# EAGLE design Nucleo_Mouse_v2 (EAGLE 9.6.2)
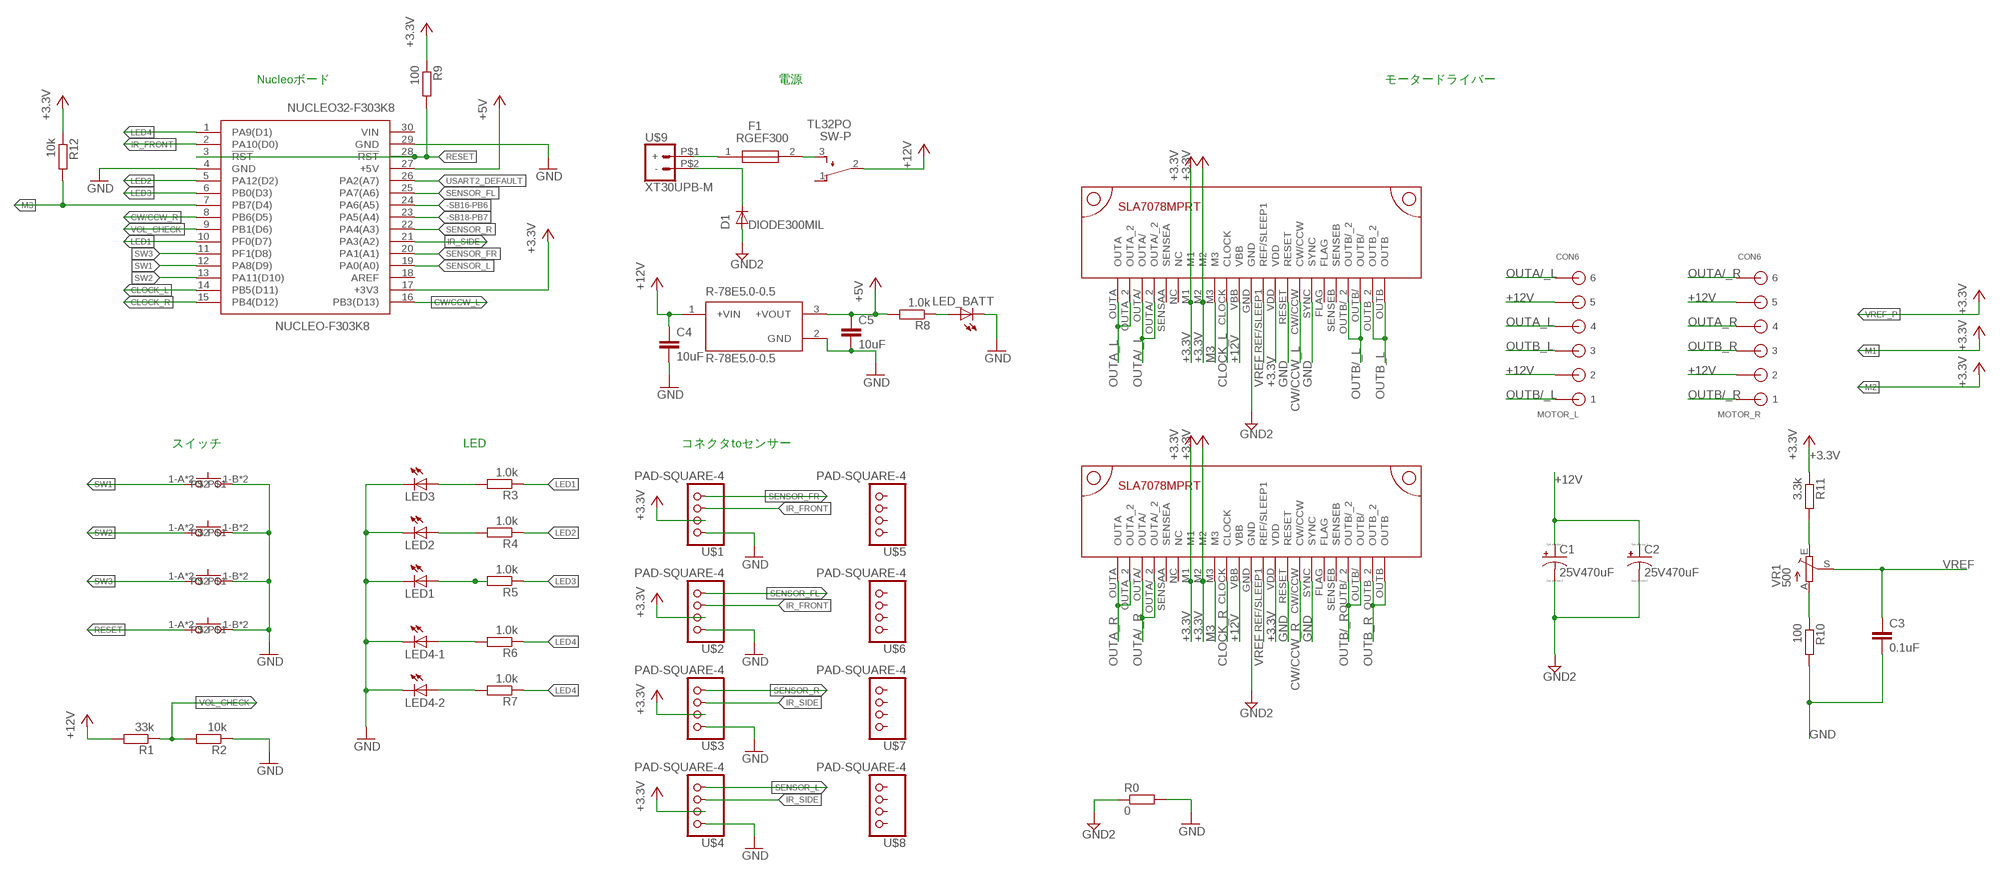
[diagram p0: schematic, sheet 1]

## Parts
C1  25V470uF  CPOL-USE5-10.5  [E5-10,5]
C2  25V470uF  CPOL-USE5-10.5  [E5-10,5]
C3  0.1uF  C-EU050-024X044  [C050-024X044]
C4  10uF  C-EU050-024X044  [C050-024X044]
C5  10uF  C-EU050-024X044  [C050-024X044]
D1  DIODE300MIL  [D-7.5]
DRIVER_L  SLA7078VANILLA  [SLA7078_VANILLA]
DRIVER_R  SLA7078VANILLA  [SLA7078_VANILLA]
F1  RGEF300  [RGEF300]
LED1  LED3MM  [LED3MM]
LED2  LED3MM  [LED3MM]
LED3  LED3MM  [LED3MM]
LED4-1  LED3MM  [LED3MM]
LED4-2  LED3MM  [LED3MM]
LED_BATT  LED3MM  [LED3MM]
MOTOR_L  CON6  [CON6]
MOTOR_R  CON6  [CON6]
NUCLEO32-F303K8  NUCLEO-F303K8  [DIPS1524W66P254L5029H1500Q30N]
R0  0  R-EU_0204/7  [0204/7]
R1  33k  R-EU_0204/7  [0204/7]
R2  10k  R-EU_0204/7  [0204/7]
R3  1.0k  R-EU_0204/7  [0204/7]
R4  1.0k  R-EU_0204/7  [0204/7]
R5  1.0k  R-EU_0204/7  [0204/7]
R6  1.0k  R-EU_0204/7  [0204/7]
R7  1.0k  R-EU_0204/7  [0204/7]
R8  1.0k  R-EU_0204/7  [0204/7]
R9  100  R-EU_0204/7  [0204/7]
R10  100  R-EU_0204/7  [0204/7]
R11  3.3k  R-EU_0204/7  [0204/7]
R12  10k  R-EU_0204/7  [0204/7]
R-78E5.0-0.5  R-78E5.0-0.5  [CONV_R-78E5.0-0.5]
SW1  TACT_SW  [AKI_TACT]
SW2  TACT_SW  [AKI_TACT]
SW3  TACT_SW  [AKI_TACT]
SW-P  TL32PO  [TL3XPO]
SW_RESET  TACT_SW  [AKI_TACT]
U$1  PAD-SQUARE-4  [PAD-SQUARE-2.54]
U$2  PAD-SQUARE-4  [PAD-SQUARE-2.54]
U$3  PAD-SQUARE-4  [PAD-SQUARE-2.54]
U$4  PAD-SQUARE-4  [PAD-SQUARE-2.54]
U$5  PAD-SQUARE-4  [PAD-SQUARE-2.54]
U$6  PAD-SQUARE-4  [PAD-SQUARE-2.54]
U$7  PAD-SQUARE-4  [PAD-SQUARE-2.54]
U$8  PAD-SQUARE-4  [PAD-SQUARE-2.54]
U$9  XT30UPB-M  [XT30UPB-M]
VR1  500  TRIM_EU-B25P  [B25P]

## Nets
+3.3V: DRIVER_L.M1 DRIVER_L.M2 DRIVER_L.VDD DRIVER_R.M1 DRIVER_R.M2 DRIVER_R.VDD NUCLEO32-F303K8.17(+3V3) R9.1 R11.1 R12.1 U$1.2-1 U$1.2-2 U$2.2-1 U$2.2-2 U$3.2-1 U$3.2-2 U$4.2-1 U$4.2-2
+5V: C5.1 NUCLEO32-F303K8.27(+5V) R8.2 R-78E5.0-0.5.3(+VOUT)
+12V: C1.+ C2.+ C4.1 DRIVER_L.VBB DRIVER_R.VBB MOTOR_L.P$2 MOTOR_L.P$5 MOTOR_R.P$2 MOTOR_R.P$5 R1.2 R-78E5.0-0.5.1(+VIN) SW-P.2(P)
-SB16-PB6: NUCLEO32-F303K8.24(PA6(A5))
-SB18-PB7: NUCLEO32-F303K8.23(PA5(A4))
CLOCK_L: DRIVER_L.CLOCK NUCLEO32-F303K8.14(PB5(D11))
CLOCK_R: DRIVER_R.CLOCK NUCLEO32-F303K8.15(PB4(D12))
CW/CCW_L: DRIVER_L.CW/CCW NUCLEO32-F303K8.16(PB3(D13))
CW/CCW_R: DRIVER_R.CW/CCW NUCLEO32-F303K8.8(PB6(D5))
GND: C3.2 C4.2 C5.2 DRIVER_L.RESET DRIVER_L.SYNC DRIVER_R.RESET DRIVER_R.SYNC LED1.K(C) LED2.K(C) LED3.K(C) LED4-1.K(C) LED4-2.K(C) LED_BATT.K(C) NUCLEO32-F303K8.4(GND) NUCLEO32-F303K8.29(GND) R0.2 R2.1 R10.2 R-78E5.0-0.5.2(GND) SW1.1-B SW1.2-B SW2.1-B SW2.2-B SW3.1-B SW3.2-B SW_RESET.1-B SW_RESET.2-B U$1.1-1 U$1.1-2 U$2.1-1 U$2.1-2 U$3.1-1 U$3.1-2 U$4.1-1 U$4.1-2
GND2: C1.- C2.- D1.A DRIVER_L.GND DRIVER_R.GND R0.1
IR_FRONT: NUCLEO32-F303K8.2(PA10(D0)) U$1.3-1 U$1.3-2 U$2.3-1 U$2.3-2
IR_SIDE: NUCLEO32-F303K8.21(PA3(A2)) U$3.3-1 U$3.3-2 U$4.3-1 U$4.3-2
LED1: NUCLEO32-F303K8.10(PF0(D7)) R3.1
LED2: NUCLEO32-F303K8.5(PA12(D2)) R4.1
LED3: NUCLEO32-F303K8.6(PB0(D3)) R5.1
LED4: NUCLEO32-F303K8.1(PA9(D1)) R6.1 R7.1
M3: DRIVER_L.M3 DRIVER_R.M3 NUCLEO32-F303K8.7(PB7(D4)) R12.2
N$1: F1.1 U$9.P$1(+)
N$2: LED4-1.A R6.2
N$3: LED4-2.A R7.2
N$4: LED3.A R3.2
N$5: LED2.A R4.2
N$6: LED1.A R5.2
N$7: LED_BATT.A R8.1
N$8: D1.C U$9.P$2(-)
N$9: F1.2 SW-P.3(S)
N$10: R10.1 VR1.A
N$11: R11.2 VR1.E
OUTA/_L [power]: DRIVER_L.OUTA/ DRIVER_L.OUTA/_2 MOTOR_L.P$6
OUTA/_R [power]: DRIVER_R.OUTA/ DRIVER_R.OUTA/_2 MOTOR_R.P$6
OUTA_L [power]: DRIVER_L.OUTA DRIVER_L.OUTA_2 MOTOR_L.P$4
OUTA_R [power]: DRIVER_R.OUTA DRIVER_R.OUTA_2 MOTOR_R.P$4
OUTB/_L [power]: DRIVER_L.OUTB/ DRIVER_L.OUTB/_2 MOTOR_L.P$1
OUTB/_R [power]: DRIVER_R.OUTB/ DRIVER_R.OUTB/_2 MOTOR_R.P$1
OUTB_L [power]: DRIVER_L.OUTB DRIVER_L.OUTB_2 MOTOR_L.P$3
OUTB_R [power]: DRIVER_R.OUTB DRIVER_R.OUTB_2 MOTOR_R.P$3
RESET: NUCLEO32-F303K8.3(!RST) NUCLEO32-F303K8.28(!RST) R9.2 SW_RESET.1-A SW_RESET.2-A
SENSOR_FL: NUCLEO32-F303K8.25(PA7(A6)) U$2.4-1 U$2.4-2
SENSOR_FR: NUCLEO32-F303K8.20(PA1(A1)) U$1.4-1 U$1.4-2
SENSOR_L: NUCLEO32-F303K8.19(PA0(A0)) U$4.4-1 U$4.4-2
SENSOR_R: NUCLEO32-F303K8.22(PA4(A3)) U$3.4-1 U$3.4-2
SW1: NUCLEO32-F303K8.12(PA8(D9)) SW1.1-A SW1.2-A
SW2: NUCLEO32-F303K8.13(PA11(D10)) SW2.1-A SW2.2-A
SW3: NUCLEO32-F303K8.11(PF1(D8)) SW3.1-A SW3.2-A
USART2_DEFAULT: NUCLEO32-F303K8.26(PA2(A7))
VOL_CHECK: NUCLEO32-F303K8.9(PB1(D6)) R1.1 R2.2
VREF [signal]: C3.1 DRIVER_L.REF/SLEEP1 DRIVER_R.REF/SLEEP1 VR1.S
Unconnected: DRIVER_L.FLAG DRIVER_L.NC DRIVER_L.SENSAA(SENSEA) DRIVER_L.SENSEB DRIVER_R.FLAG DRIVER_R.NC DRIVER_R.SENSAA(SENSEA) DRIVER_R.SENSEB NUCLEO32-F303K8.18(AREF) NUCLEO32-F303K8.30(VIN) SW-P.1(O) U$5.1-1 U$5.1-2 U$5.2-1 U$5.2-2 U$5.3-1 U$5.3-2 U$5.4-1 U$5.4-2 U$6.1-1 U$6.1-2 U$6.2-1 U$6.2-2 U$6.3-1 U$6.3-2 U$6.4-1 U$6.4-2 U$7.1-1 U$7.1-2 U$7.2-1 U$7.2-2 U$7.3-1 U$7.3-2 U$7.4-1 U$7.4-2 U$8.1-1 U$8.1-2 U$8.2-1 U$8.2-2 U$8.3-1 U$8.3-2 U$8.4-1 U$8.4-2

## Notes on the sheet
- Nucleoボード | 電源 | モータードライバー
- スイッチ | LED | コネクタtoセンサー

## Library data of the parts
C1 C2 = 02_capacitor:CPOL-US: POLARIZED CAPACITOR, American symbol
C3-C5 = 02_capacitor:C-EU: CAPACITOR, European symbol
D1 = AT:DIODE
DRIVER_L DRIVER_R = 03_MicroMouse:SLA7078
F1 = SamacSys_Parts:RGEF300: Littelfuse 3A Radial Leaded PCB Mount Resettable Fuse, 16V Source: Datasheet <http://www.littelfuse.com/~/media/electronics/datasheets/resettable_ptcs/littelfuse_ptc_rline_catalog_datasheet.pdf.pdf>; DESCRIPTION: Littelfuse 3A Radial Leaded PCB Mount Resettable Fuse, 16V; HEIGHT: 11mm; MANUFACTURER_NAME: LITTELFUSE; MANUFACTURER_PART_NUMBER: RGEF300; MOUSER_PART_NUMBER: 650-RGEF300; MOUSER_PRICE-STOCK: https://www.mouser.co.uk/ProductDetail/Littelfuse/RGEF300?qs=F6FIpiMdEVbYGAo7XYOVkg%3D%3D
LED1-LED3 LED4-1 LED4-2 LED_BATT = MicroMouseYR:LED: LEDs Standard schematic elements and footprints for 5mm, 3mm, 1206, and 0603 sized LEDs. 5mm - Spark Fun Electronics SKU : COM-00529 (and others)
MOTOR_L MOTOR_R = 03_MicroMouse:CON6: low insertion connector 6
NUCLEO32-F303K8 = NUCLEO-F303K8_2:NUCLEO-F303K8: STM32 Nucleo-32 development board Source: Datasheet <http://www.st.com/content/ccc/resource/technical/document/data_brief/b1/d8/13/d4/b0/b7/4b/6e/DM00214578.pdf/files/DM00214578.pdf/jcr:content/translations/en.DM00214578.pdf>; ARROW_PART_NUMBER: NUCLEO-F303K8; ARROW_PRICE-STOCK: https://www.arrow.com/en/products/nucleo-f303k8/stmicroelectronics; DESCRIPTION: STM32 Nucleo-32 development board; HEIGHT: 15mm; MANUFACTURER_NAME: STMicroelectronics; MANUFACTURER_PART_NUMBER: NUCLEO-F303K8; RS_PART_NUMBER: 9092862; RS_PRICE-STOCK: http://uk.rs-online.com/web/p/products/9092862
R0 R1-R12 = MicroMouseYR:R-EU_: RESISTOR, European symbol
R-78E5.0-0.5 = R-78E5.0-0.5:R-78E5.0-0.5: 0.5 Amp SIP3 Single Output Check availability <https://pricing.snapeda.com/parts/R-78E5.0-0.5/Recom%20Power/view-part?ref=eda>; AVAILABILITY: In Stock; DESCRIPTION: Switching regulator module - DC/DC converter . Single Output. 7.0V to 28.0V input voltage range and 5 V output voltage range; MF: Recom Power; MP: R-78E5.0-0.5; PACKAGE: SIP-3 Recom Power; PRICE: None; PURCHASE-URL: https://pricing.snapeda.com/search/part/R-78E5.0-0.5/?ref=eda
SW1-SW3 SW_RESET = MicroMouseYR:TACT_SW
SW-P = MicroMouseYR:TL32PO: TINY SWITCH ON - MOM Source: http://www2.produktinfo.conrad.com/datenblaetter/700000-724999/705152-da-01-de-Subminiaturschalter_TL_36YO.pdf
U$1-U$8 = pad-square:PAD-SQUARE-4
U$9 = XT30UPB-M:XT30UPB-M: Check availability <https://pricing.snapeda.com/parts/XT30UPB-M/amass/view-part?ref=eda>; AVAILABILITY: Not in stock; DESCRIPTION: Socket; DC supply; XT30; male; PIN: 2; on PCBs; THT; yellow; 15A; 500V; MF: amass; MP: XT30UPB-M; PACKAGE: None; PRICE: None
VR1 = pot:TRIM_EU-: POTENTIOMETER

## Net classes
1 signal: width 0.254 mm, clearance 0.203 mm
2 power: width 0.508 mm, clearance 0.203 mm

## Board
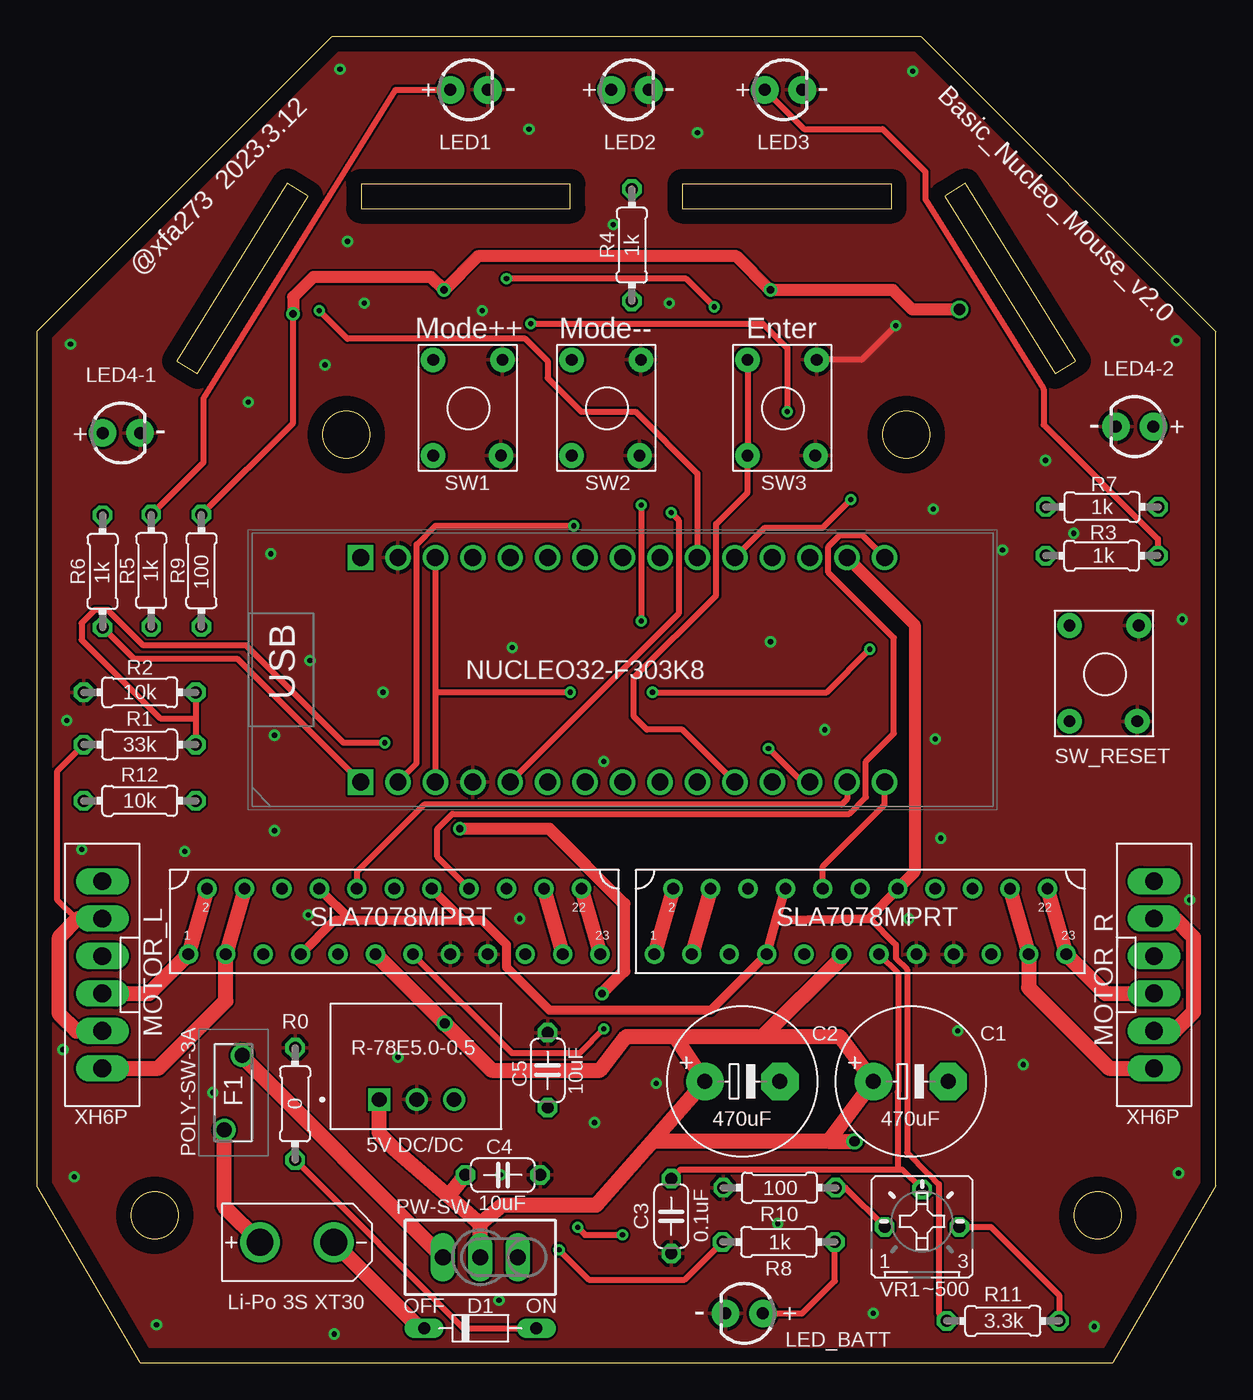
[diagram p1: board, top side]
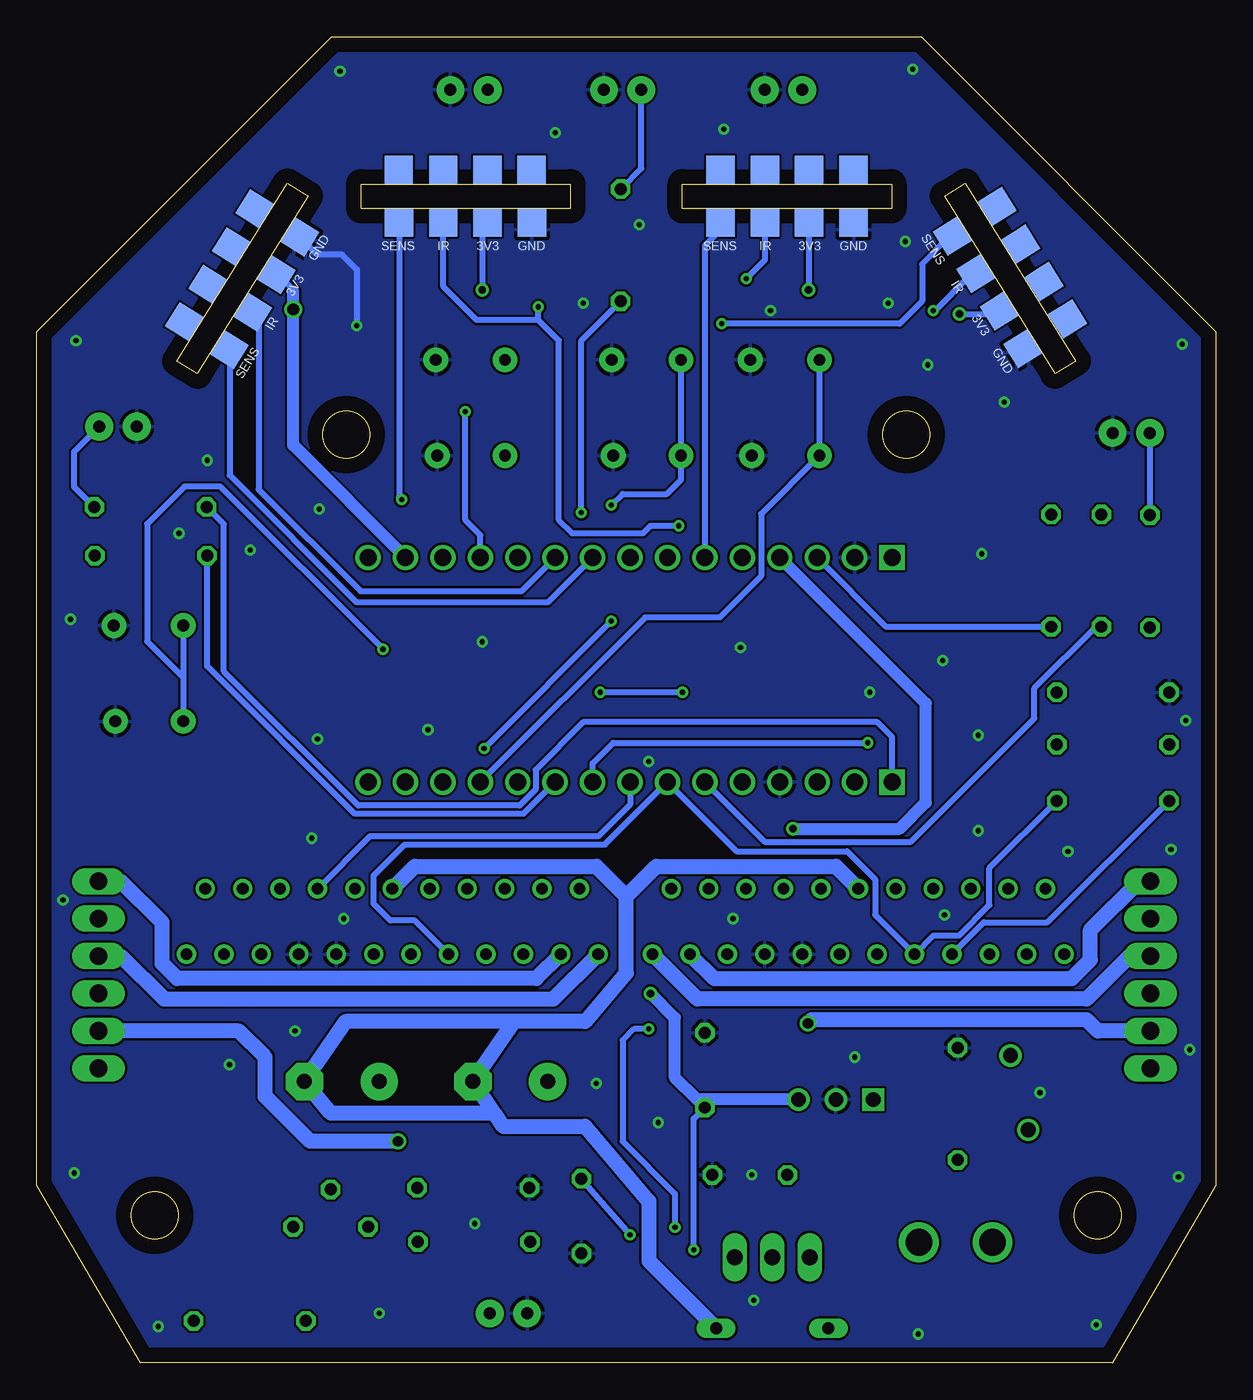
[diagram p2: board, bottom side, seen from below]

Size 80 x 90 mm. Coordinates in mm from the lower left corner, seen from the top.
Outline: 33.2,80 25,80
Outline: 25,78.35 33.2,78.35
Outline: 46.8,78.35 55,78.35
Outline: 55,80 46.8,80
Outline: 80,12 73,0 7,0 0,12 0,70 20,90 60,90 80,70 80,12
Outline: 69.1,67.13 70.5,68 63,80.06 61.6,79.19 69.1,67.13
Outline: 22,80 22,78.35 36.2,78.35 36.2,80 22,80
Outline: 58,78.35 58,80 43.8,80 43.8,78.35 58,78.35
Outline: 10.9,67.13 18.4,79.19 17,80.06 9.5,68 10.9,67.13
Outline: circle at 8,10 radius 1.6
Outline: circle at 59,63 radius 1.6
Outline: circle at 21,63 radius 1.6
Outline: circle at 72,10 radius 1.6
Outline: circle at 8,10 radius 1.6
Outline: circle at 59,63 radius 1.6
Outline: circle at 21,63 radius 1.6
Outline: circle at 72,10 radius 1.6
Copper layers (1*16): Top 0.035mm / dielectric 1.5mm / Bottom 0.035mm
Design rules "default *": minimum track width 6mil, minimum drill 0.35mm, track to track 6mil, track to pad 6mil, pad to pad 6mil, via to via 6mil, smd to smd 6mil, copper to edge 40mil, drill to drill 6mil, minimum pad ring 10mil, minimum via ring 8mil, stop-mask expansion 4mil, vias tented up to drill 1.2mm, thermal gap 10mil

### Footprints (pad centres in the part's own frame; a part is rotated, then mirrored left to right if it is on the bottom)
E5-10,5 = drill 1.016 pad 2.54: + -2.54,0 | drill 1.016 pad 2.54 octagon: - 2.54,0
C050-024X044 = drill 0.813 octagon: 1 -2.54,0; 2 2.54,0
D-7.5 = drill 0.813 long: A 3.81,0; C -3.81,0
SLA7078_VANILLA = drill 0.8: CLOCK -2.54,1.905; CW/CCW 5.08,1.905; FLAG 7.62,1.905; GND 0,1.905; M1 -6.35,-2.54; M2 -5.08,1.905; M3 -3.81,-2.54; NC -7.62,1.905; OUTA -13.97,-2.54; OUTA/ -11.43,-2.54; OUTA/_2 -10.16,1.905; OUTA_2 -12.7,1.905; OUTB 13.97,-2.54; OUTB/ 11.43,-2.54; OUTB/_2 10.16,1.905; OUTB_2 12.7,1.905; REF/SLEEP1 1.27,-2.54; RESET 3.81,-2.54; SENSAA -8.89,-2.54; SENSEB 8.89,-2.54; SYNC 6.35,-2.54; VBB -1.27,-2.54; VDD 2.54,1.905
RGEF300 = drill 1.01 pad 1.515: 1 -2.525,0.6; 2 2.525,-0.6
LED3MM = drill 0.813 pad 1.88: A -1.27,0; K 1.27,0
CON6 = drill 1.2 long: P$1 6.35,0; P$2 3.81,0; P$3 1.27,0; P$4 -1.27,0; P$5 -3.81,0; P$6 -6.35,0
DIPS1524W66P254L5029H1500Q30N = drill 1.15 pad 1.725 square: 1 -7.62,17.78; 30 7.62,17.78 | drill 1.15 pad 1.725: 2 -7.62,15.24; 3 -7.62,12.7; 4 -7.62,10.16; 5 -7.62,7.62; 6 -7.62,5.08; 7 -7.62,2.54; 8 -7.62,0; 9 -7.62,-2.54; 10 -7.62,-5.08; 11 -7.62,-7.62; 12 -7.62,-10.16; 13 -7.62,-12.7; 14 -7.62,-15.24; 15 -7.62,-17.78; 16 7.62,-17.78; 17 7.62,-15.24; 18 7.62,-12.7; 19 7.62,-10.16; 20 7.62,-7.62; 21 7.62,-5.08; 22 7.62,-2.54; 23 7.62,0; 24 7.62,2.54; 25 7.62,5.08; 26 7.62,7.62; 27 7.62,10.16; 28 7.62,12.7; 29 7.62,15.24
0204/7 = drill 0.813 octagon: 1 -3.81,0; 2 3.81,0
CONV_R-78E5.0-0.5 = drill 1 square: 1 -2.54,-2.25 | drill 1: 2 0,-2.25; 3 2.54,-2.25
AKI_TACT = drill 0.8 pad 1.676: 1-A -2.44,-3.24; 1-B 2.16,-3.24; 2-A -2.44,3.26; 2-B 2.26,3.26
TL3XPO = drill 1.1 pad 1.422 long: 1 -2.54,0; 2 0,0; 3 2.54,0
PAD-SQUARE-2.54 = smd 1.93 x 0.965: 1-1 -4.521,0.483; 1-2 -4.521,-0.483; 2-1 -1.499,0.483; 2-2 -1.499,-0.483; 3-1 1.499,0.483; 3-2 1.499,-0.483; 4-1 4.496,0.483; 4-2 4.496,-0.483
XT30UPB-M = drill 1.8: P$1 -2.5,0; P$2 2.5,0
B25P = drill 0.813 octagon: A -2.54,0; E 2.54,0; S 0,2.54

### Placement (x,y rotation side)
C1  59.3,19.09 0 top
C2  47.87,19.09 0 top
C3  43.05,9.95 270 top
C4  31.62,12.74 0 top
C5  34.67,19.85 90 top
D1  30.09,2.33 0 top
DRIVER_L  24.25,30.27 0 top
DRIVER_R  55.88,30.27 0 top
F1  13.33,18.33 90 top
LED1  29.33,86.4 0 top
LED2  40.25,86.4 0 top
LED3  50.67,86.4 0 top
LED4-1  5.74,63.11 0 top
LED4-2  74.49,63.54 180 top
LED_BATT  48,3.34 180 top
MOTOR_L  4.44,26.33 90 top
MOTOR_R  75.81,26.33 270 top
NUCLEO32-F303K8  39.75,47.03 90 top
R0  17.52,17.57 90 top
R1  6.98,41.95 180 top
R2  6.98,45.51 0 top
R3  72.26,54.78 0 top
R4  40.38,75.86 90 top
R5  7.76,53.76 90 top
R6  4.47,53.71 90 top
R7  72.28,58.08 0 top
R8  50.34,8.2 180 top
R9  11.17,53.76 270 top
R10  50.39,11.88 180 top
R11  65.55,2.84 0 top
R12  6.98,38.14 0 top
R-78E5.0-0.5  25.78,20.11 0 top
SW1  29.33,64.81 0 top
SW2  38.73,64.81 0 top
SW3  50.67,64.81 0 top
SW-P  30.09,7.15 180 top
SW_RESET  72.51,46.78 0 top
U$1  50.92,77.38 180 bottom
U$2  29.1,77.38 180 bottom
U$3  64.56,72.58 238 bottom
U$4  15.49,72.66 122 bottom
U$5  29.1,80.97 180 bottom
U$6  50.92,80.97 0 bottom
U$7  67.61,74.49 238 bottom
U$8  12.44,74.67 302 bottom
U$9  17.65,8.17 0 top
VR1  60.07,9.21 0 top

### Tracks (layer width: path | path; a pad name or v marks a point on that pad's centre or on a via)
+3.3V  (via drill 0.5, 0.8)
  Top 0.406: R11.1 61.21,3.37 61.21,12.12 60.51,12.82 60.5,12.82 59.05,14.27 59.05,26.68 58.29,27.45 58.29,28.36 56.51,30.14 | R9.1 17.39,63.8 v17.39,71.19
  Top 0.61: 50.19,30.04 DRIVER_R.M1 45.72,23.92 34.79,23.92 31.87,26.84 31.87,28.36 30.22,30.01 28.95,30.01 | 50.19,30.04 DRIVER_R.M2 | 50.19,30.04 56.51,30.14 DRIVER_R.VDD | 28.95,30.01 21.33,30.01 | 21.33,30.01 20.19,30.01 DRIVER_L.M1 | DRIVER_L.M2 21.33,30.01 | DRIVER_L.VDD 28.95,30.01
  Top 0.813: NUCLEO32-F303K8.17 59.56,50.08 59.56,33.32 DRIVER_R.VDD | v62.61,71.49 59.41,71.49 58.09,72.81 v49.78,72.81 47.49,75.1 29.92,75.1 v27.63,72.81 26.74,73.7 18.77,73.7 17.39,72.33 v17.39,71.19
  Bottom 0.406: U$4.2-2 14.59,71.64 U$4.2-1 17.34,71.13 v17.39,71.19 | U$2.2-2 U$2.2-1 27.61,72.84 v27.63,72.81 | U$1.2-2 U$1.2-1 49.78,76.55 v49.78,72.81 | U$3.2-2 63.66,73.6 U$3.2-1 62.61,72.85 62.61,72.72 | DRIVER_L.M1 15.74,29.89 11.43,29.89 R12.1
  Bottom 0.813: NUCLEO32-F303K8.17 62.61,62.27 v62.61,71.49 62.61,72.72
+5V  (via drill 0.35, 0.5)
  Top 0.406: v35.43,7.66 37.46,5.63 43.96,5.63 R8.2
  Top 0.813: v38.35,25.06 39.87,26.59 39.87,31.16 34.79,36.24 v28.7,36.24
  Bottom 0.406: v35.43,7.66 35.43,16.55 C5.1
  Bottom 0.813: v28.7,36.24 21.46,36.24 19.68,38.02 19.68,44.75 NUCLEO32-F303K8.27 | v38.35,25.06 36.7,23.41 36.7,19.35 35.21,17.86 34.67,17.86 | R-78E5.0-0.5.3 34.67,17.86 | C5.1 34.67,17.86
+12V  (via drill 0.7)
  Top 0.406: MOTOR_L.P$2 2.66,30.14 1.39,31.41 1.39,40.17 R1.2
  Top 1.016: SW-P.2 30.09,9.44 | 30.09,9.44 27.93,11.32 | 27.93,11.32 24.25,14.52 23.24,15.54 R-78E5.0-0.5.1 | C4.1 27.93,11.32 | 30.09,9.44 31.62,10.71 37.97,10.71 41.75,15.02 | 41.75,15.02 C2.+ 43.3,22.14 | 53.72,15.03 C1.+ 54.48,22.14 49.27,22.14 | 53.72,15.03 41.75,15.02 | 43.3,22.14 49.27,22.14 | 43.3,22.14 40,22.14 38.22,19.85 30.86,19.85 v27.68,23.03 DRIVER_L.VBB | MOTOR_L.P$5 2.66,22.52 1.52,23.66 1.52,28.88 2.79,30.14 MOTOR_L.P$2 | 49.27,22.14 54.61,27.47 DRIVER_R.VBB | MOTOR_R.P$5 77.21,30.14 78.47,28.88 78.47,23.79 77.21,22.52 MOTOR_R.P$2 | 53.72,15.03 v55.49,15.03
  Bottom 1.016: MOTOR_L.P$5 8,22.52 8.76,23.28 27.43,23.28 v27.68,23.03 | v55.49,15.03 61.46,15.03 64.51,18.08 64.51,20.74 66.29,22.52 MOTOR_R.P$2
CLOCK_L
  Top 0.406: NUCLEO32-F303K8.14 54.99,38.27 54.61,37.89 26.28,37.89 21.71,33.32 DRIVER_L.CLOCK
CLOCK_R
  Top 0.406: DRIVER_R.CLOCK 53.34,33.7 57.53,37.89 NUCLEO32-F303K8.15
CW/CCW_L
  Top 0.406: DRIVER_L.CW/CCW 27.17,34.33 27.17,36.24 28.19,37.25 55.11,37.25 56.26,38.4 56.26,40.81 58.16,42.71 58.16,49.19 53.72,53.64 53.72,55.41 54.48,56.18 56,56.18 NUCLEO32-F303K8.16
CW/CCW_R
  Bottom 0.406: NUCLEO32-F303K8.8 39.75,37.89 41.91,35.73 57.4,35.73 DRIVER_R.CW/CCW
GND  (via drill 0.35)
  Top 0.406: v58.29,70.4 55.96,68.07 SW3.2-B
  Bottom 0.406: v58.29,70.4 58.29,74.21 59.3,75.23 60.98,75.23 61.76,76.01 U$3.1-1 62.06,76.16 U$3.1-2 | U$4.1-2 12.99,69.08 U$4.1-1 | U$2.1-1 U$2.1-2 | U$1.1-2 U$1.1-1
  other vias: 2.28,69.13 2.03,43.6 3.04,34.84 2.53,12.62 1.77,21.25 8.12,2.58 20.19,1.95 31.36,4.23 37.84,16.3 42.03,18.96 56.76,3.34 71.75,2.45 77.47,12.87 61.34,35.6 60.95,42.33 77.72,50.46 78.23,31.41 53.46,42.97 49.78,48.94 32.25,48.56 23.49,45.51 18.54,47.67 16.12,42.59 16.12,36.11 10.03,34.71 14.35,65.19 19.55,67.73 21.08,76.11 22.22,71.92 20.57,87.8 33.4,83.73 44.83,83.48 39.11,77.26 42.92,71.92 30.22,71.42 60.83,57.95 68.45,61.26 65.53,55.16 70.35,56.3 77.34,69.38 59.43,87.67 15.87,54.91 38.48,40.81 66.92,20.23 62.48,22.52 24.51,20.74 11.93,18.33 50.29,9.44 32.76,30.14 18.41,30.39 59.18,30.14 31.49,12.74
  pour Top: -7.75,94.53 84.96,94.53 84.96,-2.88 85.09,-3.01 -5.85,-3.01 -5.97,-3.13
  pour Bottom: -16.01,101.52 89.91,101.52 90.29,101.13 90.29,-6.82 90.55,-7.07 -13.72,-7.07 -13.85,-7.2 -13.85,99.36
GND2
  Top 0.406: R0.1 28.95,2.33 D1.A
  Bottom 1.016: 47.62,23.16 42.79,23.16 40,26.46 40,31.66 | 47.62,23.16 C2.- 48.98,16.93 | 47.62,23.16 59.05,23.16 C1.- 60.05,16.93 48.98,16.93 | 48.98,16.93 48.38,16.04 42.79,16.04 38.48,10.96 38.48,6.9 D1.A | 40,31.66 37.97,33.7 25.78,33.7 DRIVER_L.GND | DRIVER_R.GND 54.35,33.7 42.03,33.7 40,31.66
IR_FRONT  (via drill 0.35)
  Top 0.406: v45.97,71.67 44.06,73.58 v31.87,73.58 | NUCLEO32-F303K8.2 25.78,40.68 25.78,55.54 27.05,56.81 v36.44,56.81
  Bottom 0.406: U$1.3-2 U$1.3-1 52.42,73.04 50.16,70.78 45.97,70.78 | U$2.3-2 U$2.3-1 30.6,74.84 v31.87,73.58 | 45.97,70.78 44.57,69.38 44.57,57.19 43.68,56.3 38.86,56.3 38.35,56.81 v36.44,56.81 | 45.97,70.78 v45.97,71.67
IR_SIDE  (via drill 0.35)
  Top 0.406: v19.17,71.42 21.08,69.51 33.14,69.51 34.67,67.99 34.67,66.84 36.95,64.56 40.63,64.56 44.83,60.37 NUCLEO32-F303K8.21
  Bottom 0.406: U$3.3-2 65.25,71.06 U$3.3-1 64.95,59.28 58.03,52.37 47.11,52.37 NUCLEO32-F303K8.21 | U$4.3-2 16.18,74.19 U$4.3-1 16.79,73.68 19.05,71.42 v19.17,71.42
LED1
  Bottom 0.406: NUCLEO32-F303K8.10 46.98,37.25 58.41,37.25 68.45,47.29 R3.1
LED2  (via drill 0.35)
  Top 0.406: v43.05,57.7 43.56,57.19 43.56,50.84 NUCLEO32-F303K8.5
  Bottom 0.406: R4.1 43.05,69.38 v43.05,57.7
LED3
  Bottom 0.406: NUCLEO32-F303K8.6 30.6,35.35 20.7,35.35 12.31,43.73 12.31,45.78 8.14,49.95 R5.1
LED4
  Top 0.406: R6.1 6.57,47.79 13.58,47.79 NUCLEO32-F303K8.1
  Bottom 0.406: R7.1 67.31,56.91 67.31,46.93 58.18,37.81 47.24,37.81 46.15,38.91 46.15,40.25 42.92,43.48 22.98,43.48 21.97,42.46 NUCLEO32-F303K8.1
M3
  Bottom 0.406: DRIVER_R.M3 54.35,30.01 56,30.01 57.14,31.16 57.14,33.06 55.04,35.17 41.45,35.17 NUCLEO32-F303K8.7 32.51,34.71 25.01,34.71 23.11,32.81 23.11,30.39 DRIVER_L.M3 19.17,29 17.42,29 15.36,31.06 15.36,33.57 R12.2
N$1
  Top 1.016: U$9.P$1 12.73,10.59 F1.1
N$2
  Bottom 0.406: LED4-1.A R6.2
N$3
  Bottom 0.406: R7.2 77.47,59.45 77.47,61.84 LED4-2.A
N$4
  Top 0.406: R3.2 76.07,55.92 68.32,63.67 68.32,66.08 60.3,78.97 60.3,80.84 57.4,83.73 52.06,83.73 LED3.A
N$5
  Bottom 0.406: R4.2 38.98,81.07 LED2.A
N$6
  Top 0.406: R5.2 11.3,61.11 11.3,65.41 24.35,86.4 LED1.A
N$7
  Top 0.406: LED_BATT.A 51.94,3.34 54.15,5.55 R8.1
N$8
  Top 1.016: U$9.P$2 25.99,2.33 D1.C
N$9
  Top 1.016: F1.2 13.93,20.78 SW-P.3
N$10
  Top 0.406: R10.1 54.86,11.88 VR1.A
N$11
  Top 0.406: VR1.E 64.74,9.21 69.36,4.59 R11.2
OUTA/_L
  Top 1.016: DRIVER_L.OUTA/_2 DRIVER_L.OUTA/ 12.82,24.55 8.25,19.98 MOTOR_L.P$6
OUTA/_R
  Top 1.016: DRIVER_R.OUTA/_2 DRIVER_R.OUTA/
  Bottom 1.016: DRIVER_R.OUTA/ 46.1,26.08 70.48,26.08 71.5,27.09 71.5,29.89 74.29,32.68 MOTOR_R.P$6
OUTA_L
  Top 1.016: DRIVER_L.OUTA_2 DRIVER_L.OUTA 7.62,25.06 MOTOR_L.P$4
OUTA_R
  Top 1.016: DRIVER_R.OUTA_2 DRIVER_R.OUTA
  Bottom 1.016: MOTOR_R.P$4 74.29,27.6 71.37,24.68 44.95,24.68 DRIVER_R.OUTA
OUTB/_L
  Top 1.016: DRIVER_L.OUTB/_2 DRIVER_L.OUTB/
  Bottom 1.016: DRIVER_L.OUTB/ 34.03,26.08 9.77,26.08 8.5,27.35 8.5,29.38 5.2,32.68 MOTOR_L.P$1
OUTB/_R
  Top 1.016: DRIVER_R.OUTB/_2 DRIVER_R.OUTB/ 67.31,25.44 72.77,19.98 MOTOR_R.P$1
OUTB_L
  Top 1.016: DRIVER_L.OUTB_2 DRIVER_L.OUTB
  Bottom 1.016: MOTOR_L.P$3 5.84,27.6 8.76,24.68 35.17,24.68 DRIVER_L.OUTB
OUTB_R
  Top 1.016: DRIVER_R.OUTB_2 DRIVER_R.OUTB 72.51,25.06 MOTOR_R.P$3
RESET  (via drill 0.35)
  Top 0.406: v41.78,45.51 53.59,45.51 v56.51,48.43 | NUCLEO32-F303K8.28 27.05,45.63 | 27.05,45.63 NUCLEO32-F303K8.3 | v36.19,45.51 27.17,45.51 27.05,45.63
  Bottom 0.406: v36.19,45.51 v41.78,45.51 | SW_RESET.2-A 70.07,46.52 | 70.07,46.52 SW_RESET.1-A | v56.51,48.43 67.56,59.48 69.97,59.48 72.51,56.94 72.51,48.96 70.07,46.52 | R9.2 22.35,49.95 NUCLEO32-F303K8.28
SENSOR_FL
  Bottom 0.406: U$2.4-2 U$2.4-1 34.67,75.84 NUCLEO32-F303K8.25
SENSOR_FR  (via drill 0.35)
  Top 0.406: NUCLEO32-F303K8.20 49.4,56.68 53.34,56.68 v55.24,58.59
  Bottom 0.406: U$1.4-2 U$1.4-1 55.42,58.77 v55.24,58.59
SENSOR_L  (via drill 0.35)
  Top 0.406: v33.52,70.53 49.27,70.53 50.92,68.88 v50.92,64.56
  Bottom 0.406: U$4.4-2 17.77,76.73 U$4.4-1 19.93,74.56 19.93,72.05 21.46,70.53 v33.52,70.53 | NUCLEO32-F303K8.19 49.91,56.18 50.92,57.19 v50.92,64.56
SENSOR_R
  Bottom 0.406: NUCLEO32-F303K8.22 45.33,51.6 58.29,51.6 66.92,60.24 66.92,68.32 66.81,68.5 66.72,68.64 | U$3.4-1 66.66,68.64 66.72,68.64 | U$3.4-2 66.96,68.64 66.72,68.64
SW1
  Bottom 0.406: SW1.2-A SW1.1-A 30.86,57.61 30.86,53.38 33.65,50.59 38.73,50.59 NUCLEO32-F303K8.12
SW2  (via drill 0.35)
  Top 0.406: v41.02,58.21 v41.02,50.33 | v49.65,41.7 51.94,39.41 NUCLEO32-F303K8.13
  Bottom 0.406: SW2.2-A SW2.1-A 36.29,59.92 37.24,58.97 40.25,58.97 v41.02,58.21 | v41.02,50.33 v49.65,41.7
SW3
  Top 0.406: SW3.2-A SW3.1-A 48.23,59.07 46.1,56.94 46.1,52.08 40.51,46.5 40.51,43.86 41.4,42.97 43.81,42.97 NUCLEO32-F303K8.11
VOL_CHECK  (via drill 0.35)
  Top 0.406: R2.2 10.79,43.73 | 10.79,43.73 R1.1 | v23.62,42.08 20.82,42.08 14.22,48.68 7.23,48.68 4.82,51.1 3.93,51.1 3.04,50.21 3.04,49.06 8.38,43.73 10.79,43.73
  Bottom 0.406: NUCLEO32-F303K8.9 42.29,40.68 40.89,42.08 v23.62,42.08
VREF  (via drill 0.35)
  Top 0.406: v36.7,9.19 37.21,8.68 v39.75,8.68 | C3.1 43.68,13.12 58.41,13.12 | VR1.S 58.69,13.12 58.41,13.12 | 58.41,13.12 58.41,18.37 58.44,18.4 58.44,26.43 DRIVER_R.REF/SLEEP1 | v38.48,22.65 36.83,21 32.25,21 DRIVER_L.REF/SLEEP1
  Bottom 0.406: v36.7,9.19 36.7,11.47 40.25,15.03 40.25,21.89 39.49,22.65 v38.48,22.65 | v39.75,8.68 C3.1

### Text on the board
tPlace: + | - | + | - | + | - | Mode++ | Mode-- | Enter | - | - | + | + | USB | OFF | ON | - | +
bPlace: SENS | GND | 3V3 | IR | SENS | GND | 3V3 | IR | SENS | GND | IR | 3V3 | 3V3 | IR | GND | SENS
tNames: @xfa273 2023.3.12 | 1k | Basic_Nucleo_Mouse_v2.0 | 1k | 1k | 1k | 1k | 100 | 10k | 33k | 10k | R0 | 10uF | 0 | XH6P | 470uF | 470uF | XH6P | POLY-SW-3A | 5V DC/DC | 100 | PW-SW | 10uF | 0.1uF | 1k | Li-Po 3S XT30 | ~500 | D1 | 3.3k
tValues: 0